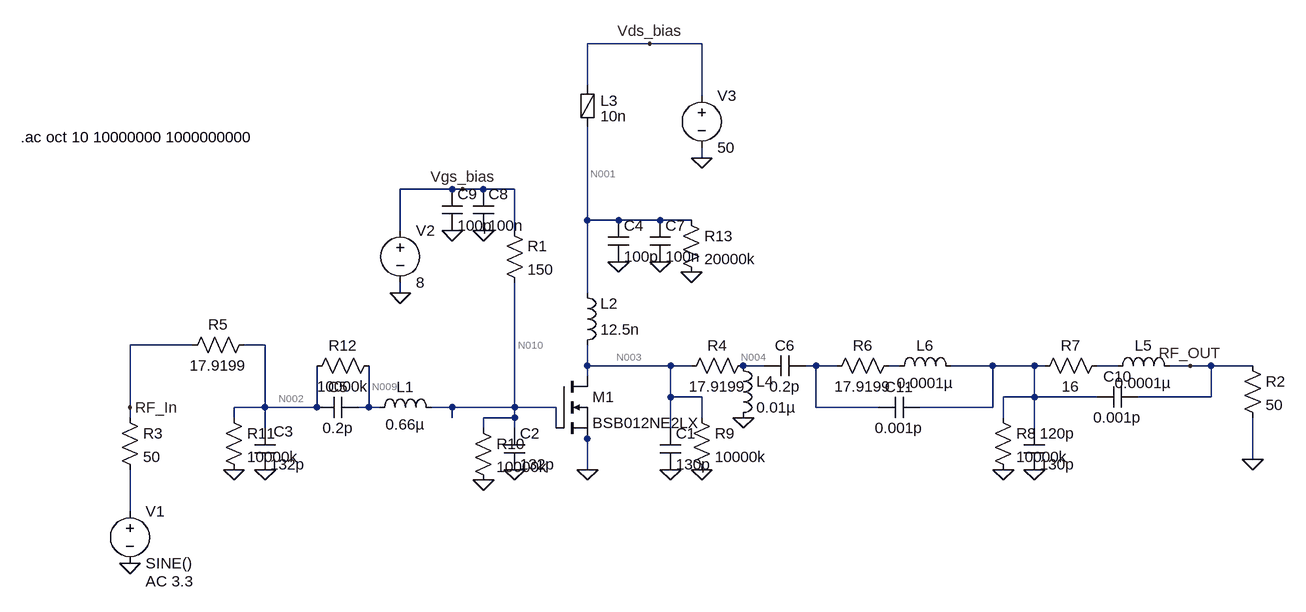
[diagram p0: schematic amp_filter_433MHz.asc]
amp_filter_433MHz.asc, the LTspice schematic file:
Version 4
SHEET 1 1384 680
WIRE 400 -432 304 -432
WIRE 480 -432 400 -432
WIRE 304 -368 304 -432
WIRE 480 -352 480 -432
WIRE 480 -256 480 -272
WIRE 96 -208 16 -208
WIRE 112 -208 96 -208
WIRE 144 -208 112 -208
WIRE 192 -208 144 -208
WIRE 304 -160 304 -304
WIRE 352 -160 304 -160
WIRE 416 -160 352 -160
WIRE 464 -160 416 -160
WIRE 16 -144 16 -208
WIRE 192 -144 192 -208
WIRE 16 -48 16 -64
WIRE 304 -48 304 -160
WIRE -304 32 -400 32
WIRE -192 32 -224 32
WIRE 304 64 304 32
WIRE 432 64 304 64
WIRE 464 64 432 64
WIRE 576 64 544 64
WIRE 656 64 640 64
WIRE 688 64 656 64
WIRE 784 64 768 64
WIRE 928 64 864 64
WIRE 992 64 928 64
WIRE 1008 64 992 64
WIRE 1120 64 1088 64
WIRE 1232 64 1200 64
WIRE 1264 64 1232 64
WIRE 1328 64 1264 64
WIRE 304 80 304 64
WIRE 432 112 432 64
WIRE 480 112 432 112
WIRE 992 112 992 64
WIRE 992 112 944 112
WIRE 1088 112 992 112
WIRE 1264 112 1264 64
WIRE 1264 112 1152 112
WIRE -400 128 -400 32
WIRE -192 128 -192 32
WIRE -192 128 -240 128
WIRE -112 128 -112 64
WIRE -112 128 -192 128
WIRE -32 128 -32 64
WIRE -32 128 -48 128
WIRE -16 128 -32 128
WIRE 96 128 64 128
WIRE 192 128 192 -64
WIRE 192 128 96 128
WIRE 256 128 192 128
WIRE 656 128 656 64
WIRE 752 128 656 128
WIRE 928 128 928 64
WIRE 928 128 816 128
WIRE -400 144 -400 128
WIRE -240 144 -240 128
WIRE 96 144 96 128
WIRE 192 144 192 128
WIRE 192 144 144 144
WIRE 480 144 480 112
WIRE 944 144 944 112
WIRE -192 160 -192 128
WIRE 144 160 144 144
WIRE 192 160 192 144
WIRE 256 160 256 128
WIRE 432 160 432 112
WIRE 992 160 992 112
WIRE 304 176 304 160
WIRE 1328 208 1328 144
WIRE 304 224 304 176
WIRE -400 288 -400 224
FLAG 192 224 0
FLAG 992 224 0
FLAG 304 224 0
FLAG -400 368 0
FLAG -400 128 RF_In
FLAG 432 224 0
FLAG 1328 208 0
FLAG 1232 64 RF_OUT
FLAG 16 -48 0
FLAG -192 224 0
FLAG 112 -208 Vgs_bias
FLAG 400 -432 Vds_bias
FLAG 480 -256 0
FLAG 352 -96 0
FLAG 416 -96 0
FLAG 96 -144 0
FLAG 144 -144 0
FLAG 544 144 0
FLAG 944 224 0
FLAG 480 224 0
FLAG 144 240 0
FLAG -240 224 0
FLAG 464 -80 0
SYMBOL cap 176 160 R0
SYMATTR InstName C2
SYMATTR Value 132p
SYMBOL ind -32 144 R270
WINDOW 0 32 56 VTop 2
WINDOW 3 5 56 VBottom 2
SYMATTR InstName L1
SYMATTR Value 0.66µ
SYMBOL ind 288 48 M180
WINDOW 0 36 80 Left 2
WINDOW 3 36 40 Left 2
SYMATTR InstName L2
SYMATTR Value 12.5n
SYMBOL cap 976 160 R0
SYMATTR InstName 120p
SYMATTR Value 130p
SYMBOL voltage -400 272 R0
WINDOW 123 24 124 Left 2
WINDOW 39 0 0 Left 2
SYMATTR Value2 AC 3.3
SYMATTR InstName V1
SYMATTR Value SINE()
SYMBOL cap 416 160 R0
SYMATTR InstName C1
SYMATTR Value 130p
SYMBOL res 1312 48 R0
SYMATTR InstName R2
SYMATTR Value 50
SYMBOL res -416 128 R0
SYMATTR InstName R3
SYMATTR Value 50
SYMBOL voltage 16 -160 R0
WINDOW 123 0 0 Left 2
WINDOW 39 0 0 Left 2
SYMATTR InstName V2
SYMATTR Value 8
SYMBOL res 176 -160 R0
SYMATTR InstName R1
SYMATTR Value 150
SYMBOL cap -208 160 R0
WINDOW 0 29 5 Left 2
SYMATTR InstName C3
SYMATTR Value 132p
SYMBOL cap -48 112 R90
WINDOW 0 0 32 VBottom 2
WINDOW 3 32 32 VTop 2
SYMATTR InstName C5
SYMATTR Value 0.2p
SYMBOL res -208 16 R90
WINDOW 0 0 56 VBottom 2
WINDOW 3 32 56 VTop 2
SYMATTR InstName R5
SYMATTR Value 17.9199
SYMBOL cap 640 48 R90
WINDOW 0 0 32 VBottom 2
WINDOW 3 32 32 VTop 2
SYMATTR InstName C6
SYMATTR Value 0.2p
SYMBOL voltage 480 -368 R0
WINDOW 123 0 0 Left 2
WINDOW 39 0 0 Left 2
SYMATTR InstName V3
SYMATTR Value 50
SYMBOL cap 336 -160 R0
SYMATTR InstName C4
SYMATTR Value 100p
SYMBOL cap 400 -160 R0
SYMATTR InstName C7
SYMATTR Value 100n
SYMBOL res 560 48 R90
WINDOW 0 0 56 VBottom 2
WINDOW 3 32 56 VTop 2
SYMATTR InstName R4
SYMATTR Value 17.9199
SYMBOL FerriteBead 304 -336 R0
SYMATTR InstName L3
SYMATTR Value 10n
SYMBOL cap 128 -208 R0
SYMATTR InstName C8
SYMATTR Value 100n
SYMBOL cap 80 -208 R0
SYMATTR InstName C9
SYMATTR Value 100p
SYMBOL ind 528 48 R0
SYMATTR InstName L4
SYMATTR Value 0.01µ
SYMBOL res 1104 48 R90
WINDOW 0 0 56 VBottom 2
WINDOW 3 32 56 VTop 2
SYMATTR InstName R7
SYMATTR Value 16
SYMBOL res 784 48 R90
WINDOW 0 0 56 VBottom 2
WINDOW 3 32 56 VTop 2
SYMATTR InstName R6
SYMATTR Value 17.9199
SYMBOL nmos 256 80 R0
SYMATTR InstName M1
SYMATTR Value BSB012NE2LX
SYMBOL ind 1104 80 R270
WINDOW 0 32 56 VTop 2
WINDOW 3 5 56 VBottom 2
SYMATTR InstName L5
SYMATTR Value 0.0001µ
SYMBOL cap 1152 96 R90
WINDOW 0 0 32 VBottom 2
WINDOW 3 32 32 VTop 2
SYMATTR InstName C10
SYMATTR Value 0.001p
SYMBOL ind 768 80 R270
WINDOW 0 32 56 VTop 2
WINDOW 3 5 56 VBottom 2
SYMATTR InstName L6
SYMATTR Value 0.0001µ
SYMBOL cap 816 112 R90
WINDOW 0 0 32 VBottom 2
WINDOW 3 32 32 VTop 2
SYMATTR InstName C11
SYMATTR Value 0.001p
SYMBOL res 928 128 R0
SYMATTR InstName R8
SYMATTR Value 10000k
SYMBOL res 464 128 R0
SYMATTR InstName R9
SYMATTR Value 10000k
SYMBOL res 128 144 R0
SYMATTR InstName R10
SYMATTR Value 10000k
SYMBOL res -256 128 R0
SYMATTR InstName R11
SYMATTR Value 10000k
SYMBOL res -128 80 R270
WINDOW 0 32 56 VTop 2
WINDOW 3 0 56 VBottom 2
SYMATTR InstName R12
SYMATTR Value 10000k
SYMBOL res 448 -176 R0
SYMATTR InstName R13
SYMATTR Value 20000k
TEXT -568 -288 Left 2 !.ac oct 10 10000000 1000000000

The netlist it stands for:
* amp_filter_433MHz.asc
C2 N010 0 132p
L1 N009 N010 0.66µ
L2 N003 N001 12.5n
C§120p N007 0 130p
V1 N011 0 SINE() AC 3.3
C1 N003 0 130p
R2 RF_OUT 0 50
R3 RF_In N011 50
V2 Vgs_bias 0 8
R1 Vgs_bias N010 150
C3 N002 0 132p
C5 N009 N002 0.2p
R5 N002 RF_In 17.9199
C6 N005 N004 0.2p
V3 Vds_bias 0 50
C4 N001 0 100p
C7 N001 0 100n
R4 N004 N003 17.9199
L3 Vds_bias N001 10n
C8 Vgs_bias 0 100n
C9 Vgs_bias 0 100p
L4 N004 0 0.01µ
R7 N008 N007 16
R6 N006 N005 17.9199
M1 N003 N010 0 0 BSB012NE2LX
L5 N008 RF_OUT 0.0001µ
C10 RF_OUT N007 0.001p
L6 N006 N007 0.0001µ
C11 N007 N005 0.001p
R8 N007 0 10000k
R9 N003 0 10000k
R10 N010 0 10000k
R11 N002 0 10000k
R12 N002 N009 10000k
R13 N001 0 20000k
.model NMOS NMOS
.model PMOS PMOS
.lib standard.mos
.ac oct 10 10000000 1000000000
.backanno
.end

* Results of the author's LTspice run, read from the files saved beside the schematic
* Operating Point, zero values left out:
*   V(n010) = 8 V
*   V(n009) = 8 V
*   V(n003) = 18.4 V
*   V(n001) = 34.2 V
*   V(rf_in) = 40 µV
*   V(vgs_bias) = 8 V
*   V(n002) = 54.33 µV
*   V(n004) = 1.027 mV
*   V(vds_bias) = 50 V
*   Id(M1) = 15.8 kA
*   Ig(M1) = -858.1 pA
*   Is(M1) = -15.8 kA
*   I(L4) = 1.027 A
*   I(L3) = 15.8 kA
*   I(L2) = -15.8 kA
*   I(L1) = -800 nA
*   I(R13) = 1.71 µA
*   I(R12) = -800 nA
*   I(R11) = 5.433 pA
*   I(R10) = 800 nA
*   I(R9) = 1.84 µA
*   I(R4) = -1.027 A
*   I(R5) = 800 nA
*   I(R1) = 1.6 µA
*   I(R3) = 800 nA
*   I(V3) = -15.8 kA
*   I(V2) = -1.6 µA
*   I(V1) = 800 nA